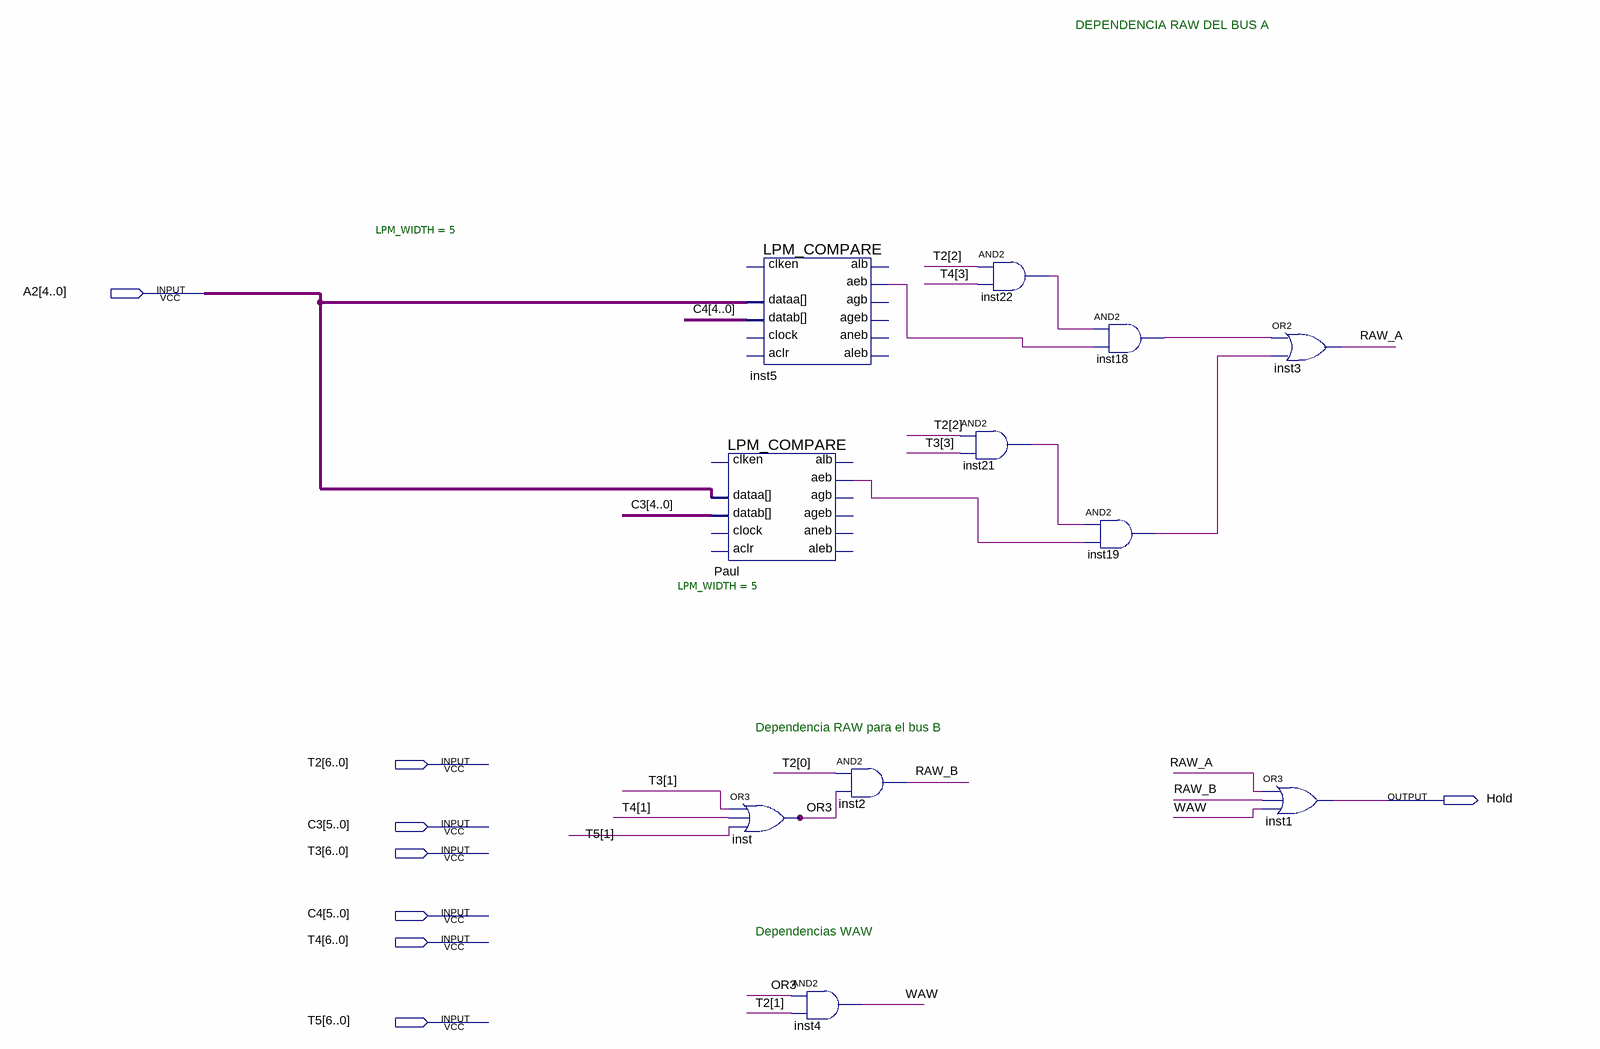
[diagram p0: schematic sheet]
// Quartus schematic UC2.bdf as structural Verilog: 11 symbols, 8 pins
module UC2 (
  input  [4:0] A2,
  input  [6:0] T2,
  input  [5:0] C3,
  input  [6:0] T3,
  input  [5:0] C4,
  input  [6:0] T4,
  input  [6:0] T5,
  output Hold
);

  wire inst5_aeb, inst18_out, inst19_out, inst21_out, inst22_out, OR3, Paul_aeb, RAW_A, RAW_B, WAW;

  LPM_COMPARE #(.LPM_WIDTH(5)) inst5 (
    .dataa(A2), .datab(C4[4:0]), .aeb(inst5_aeb));  // open: clock, aclr, clken, aleb, agb, aneb, ageb, alb
  LPM_COMPARE #(.LPM_WIDTH(5)) Paul (
    .dataa(A2), .datab(C3[4:0]), .aeb(Paul_aeb));  // open: clock, aclr, clken, aleb, agb, aneb, ageb, alb
  or inst (OR3, T3[1], T4[1], T5[1]);
  and inst4 (WAW, OR3, T2[1]);
  and inst2 (RAW_B, T2[0], OR3);
  and inst21 (inst21_out, T2[2], T3[3]);
  and inst22 (inst22_out, T2[2], T4[3]);
  and inst18 (inst18_out, inst22_out, inst5_aeb);
  and inst19 (inst19_out, inst21_out, Paul_aeb);
  or inst3 (RAW_A, inst18_out, inst19_out);
  or inst1 (Hold, RAW_A, RAW_B, WAW);

  // Notes on the sheet:
  //   DEPENDENCIA RAW DEL BUS A
  //   Dependencia RAW para el bus B
  //   Dependencias WAW
endmodule
